# Altium schematic sheet [05] RTC_RS232_USB.SchDoc: RTC_RS232_USB
size A4
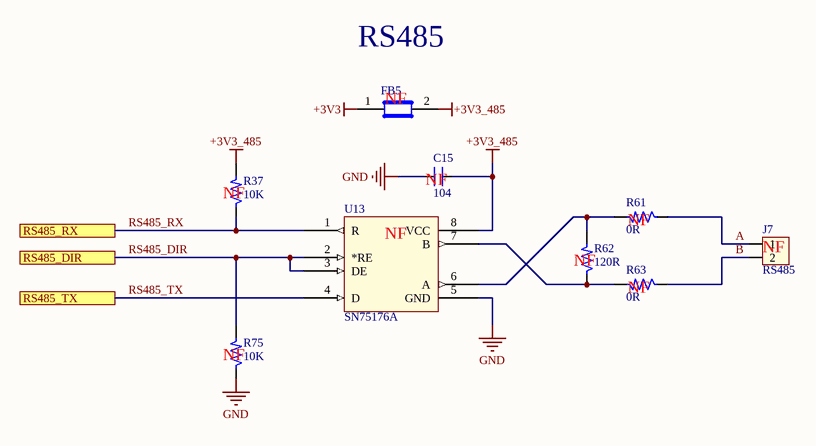
[diagram p0: [05] RTC_RS232_USB.SchDoc]

## Parts
C15  104  [C0603 SMT]
FB5  BLM21PG600SN1D  [R0805]  (value not drawn)
J7  RS485  [Hed2V_3.96]
R37  10K  [R0603 -SMT]
R61  0R  [R0603 -SMT]
R62  120R  [R0603 -SMT]
R63  0R  [R0603 -SMT]
R75  10K  [R0603 -SMT]
U13  SN75176A  [SN75176A]

## Ports
RS485_DIR, RS485_RX, RS485_TX

## Nets
+3V3: FB5.1
+3V3_485: C15.2 FB5.2 R37.2 U13.8(VCC)
GND: C15.1 R75.1 U13.5(GND)
A: J7.1 R61.1
B: J7.2 R63.1
RS485_DIR: R75.2 U13.2(*RE) U13.3(DE) ; port RS485_DIR
RS485_RX: R37.1 U13.1(R) ; port RS485_RX
RS485_TX: U13.4(D) ; port RS485_TX
NetR61_2: R61.2 R62.2 U13.6(A)
NetR62_1: R62.1 R63.2 U13.7(B)

## Notes on the sheet
- RS485
- (near FB5) NF
- (near C15) NF
- (near R37) NF
- (near U13) NF
- (near R61) NF
- (near J7) NF
- (near R62) NF
- (near R63) NF
- (near R75) NF
- Title
- Size:
- Date:
- A4
- Number:
- Time:
- Revision:
- Sheet
- of
- File:

## Library data of the parts
C15 = CM: Cap SMD; Value: 103
FB5 = Ferrite Bead
J7 = Hed2: Header 2 (Green); Value: Header 2
R37 R61-R63 R75 = RM: Resistor SMD; Value: 1K